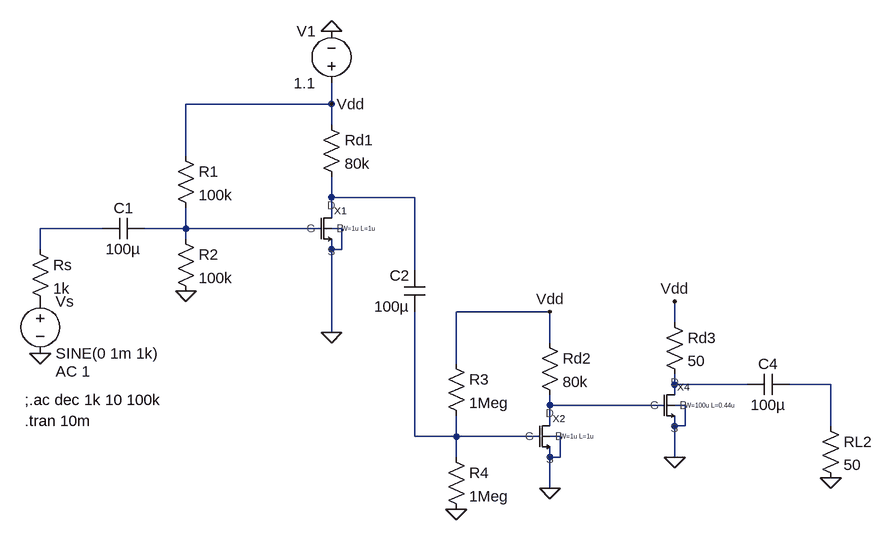
[diagram p0: schematic Draft4.asc]
Draft4.asc, the LTspice schematic file:
Version 4
SHEET 1 1812 772
WIRE -352 32 -352 0
WIRE -352 32 -576 32
WIRE -352 64 -352 32
WIRE -576 112 -576 32
WIRE -352 176 -352 144
WIRE -224 176 -352 176
WIRE -352 208 -352 176
WIRE -704 224 -800 224
WIRE -576 224 -576 192
WIRE -576 224 -640 224
WIRE -368 224 -576 224
WIRE -336 224 -352 224
WIRE -576 240 -576 224
WIRE -800 256 -800 224
WIRE -352 256 -352 240
WIRE -336 256 -336 224
WIRE -336 256 -352 256
WIRE -224 288 -224 176
WIRE -16 352 -160 352
WIRE 176 368 176 336
WIRE -352 384 -352 256
WIRE -16 400 -16 352
WIRE -160 432 -160 352
WIRE 176 464 176 448
WIRE 288 464 176 464
WIRE 416 464 352 464
WIRE 176 480 176 464
WIRE -16 496 -16 480
WIRE 160 496 -16 496
WIRE 192 496 176 496
WIRE -16 528 -16 496
WIRE 176 528 176 512
WIRE 192 528 192 496
WIRE 192 528 176 528
WIRE 416 528 416 464
WIRE -224 544 -224 352
WIRE -160 544 -160 512
WIRE -160 544 -224 544
WIRE -32 544 -160 544
WIRE 0 544 -16 544
WIRE -160 576 -160 544
WIRE -16 576 -16 560
WIRE 0 576 0 544
WIRE 0 576 -16 576
WIRE 176 576 176 528
WIRE -16 624 -16 576
FLAG -352 -80 0
FLAG -576 320 0
FLAG -800 416 0
FLAG -352 384 0
FLAG -352 32 Vdd
FLAG -16 624 0
FLAG -16 352 Vdd
FLAG -160 656 0
FLAG 176 576 0
FLAG 416 608 0
FLAG 176 336 Vdd
SYMBOL nmos65 -336 224 R0
WINDOW 39 0 0 Left 0
SYMATTR SpiceLine W=1u L=1u
SYMATTR InstName X1
SYMBOL voltage -352 16 R180
WINDOW 0 24 96 Left 2
WINDOW 3 24 16 Left 2
WINDOW 123 0 0 Left 0
WINDOW 39 0 0 Left 0
SYMATTR InstName V1
SYMATTR Value 1.1
SYMBOL res -592 96 R0
SYMATTR InstName R1
SYMATTR Value 100k
SYMBOL res -592 224 R0
SYMATTR InstName R2
SYMATTR Value 100k
SYMBOL cap -640 208 R90
WINDOW 0 0 32 VBottom 2
WINDOW 3 32 32 VTop 2
SYMATTR InstName C1
SYMATTR Value 100µ
SYMBOL res -816 240 R0
SYMATTR InstName Rs
SYMATTR Value 1k
SYMBOL voltage -800 320 R0
WINDOW 123 24 124 Left 2
WINDOW 39 0 0 Left 0
SYMATTR Value2 AC 1
SYMATTR InstName Vs
SYMATTR Value SINE(0 1m 1k)
SYMBOL res -368 48 R0
SYMATTR InstName Rd1
SYMATTR Value 80k
SYMBOL res -32 384 R0
SYMATTR InstName Rd2
SYMATTR Value 80k
SYMBOL nmos65 0 544 R0
WINDOW 39 0 0 Left 0
SYMATTR SpiceLine W=1u L=1u
SYMATTR InstName X2
SYMBOL cap -208 352 R180
WINDOW 0 24 56 Left 2
WINDOW 3 24 8 Left 2
SYMATTR InstName C2
SYMATTR Value 100µ
SYMBOL res -176 416 R0
SYMATTR InstName R3
SYMATTR Value 1Meg
SYMBOL res -176 560 R0
SYMATTR InstName R4
SYMATTR Value 1Meg
SYMBOL nmos65 192 496 R0
WINDOW 39 0 0 Left 0
SYMATTR SpiceLine W=100u L=0.44u
SYMATTR InstName X4
SYMBOL res 160 352 R0
SYMATTR InstName Rd3
SYMATTR Value 50
SYMBOL cap 352 448 R90
WINDOW 0 0 32 VBottom 2
WINDOW 3 32 32 VTop 2
SYMATTR InstName C4
SYMATTR Value 100µ
SYMBOL res 400 512 R0
SYMATTR InstName RL2
SYMATTR Value 50
TEXT -824 488 Left 2 !;.ac dec 1k 10 100k
TEXT -824 520 Left 2 !.tran 10m

The netlist it stands for:
* Draft4.asc
XX1 N003 N001 0 0 nmos65 params: W=1u L=1u  ; pins G D S B
V1 Vdd 0 1.1
R1 Vdd N003 100k
R2 N003 0 100k
C1 N003 N002 100µ
Rs N002 P001 1k
Vs P001 0 SINE(0 1m 1k) AC 1
Rd1 Vdd N001 80k
Rd2 Vdd N006 80k
XX2 N007 N006 0 0 nmos65 params: W=1u L=1u  ; pins G D S B
C2 N007 N001 100µ
R3 Vdd N007 1Meg
R4 N007 0 1Meg
XX4 N006 N004 0 0 nmos65 params: W=100u L=0.44u  ; pins G D S B
Rd3 Vdd N004 50
C4 N005 N004 100µ
RL2 N005 0 50
;.ac dec 1k 10 100k
.tran 10m
.backanno
.end